# EasyEDA Pro project Sensor_colis_examples.epro, board 2024-06-03_06-10-35
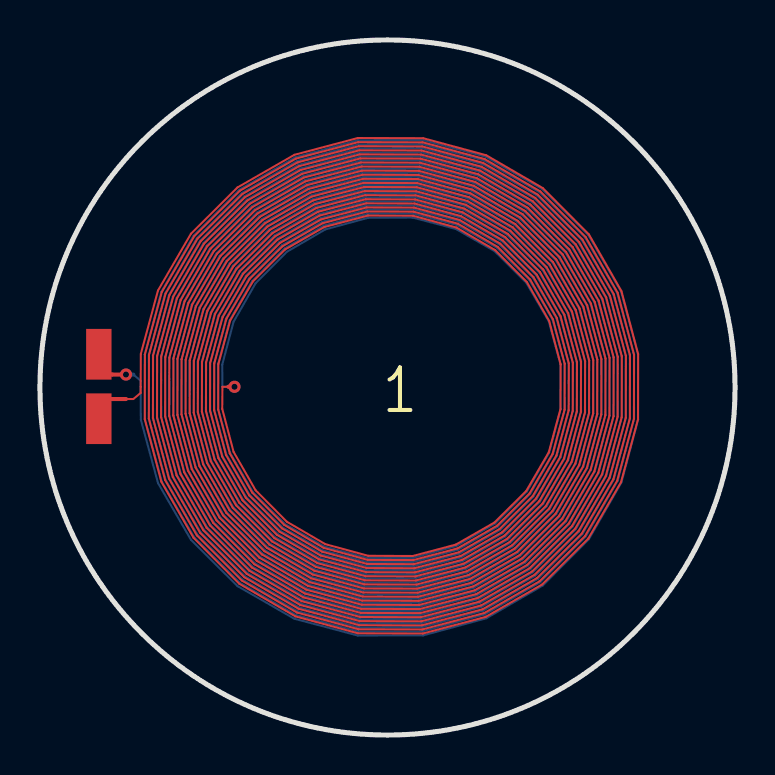
[diagram p0: board, top side]
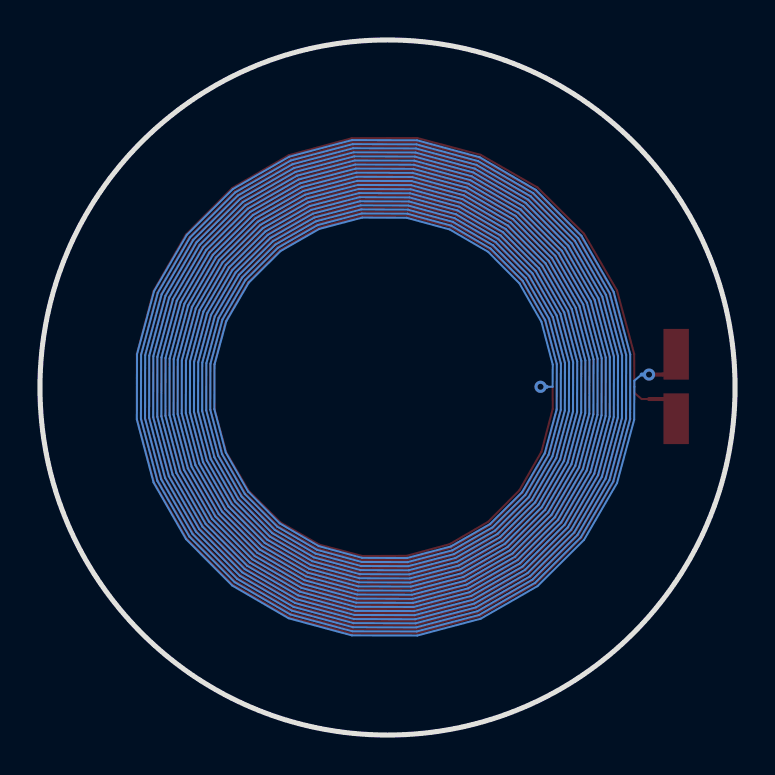
[diagram p1: board, bottom side, seen from below]

Outline 34.8 x 34.8 mm; copper layers: Top Layer, Bottom Layer. Coordinates in mm from the lower left corner of the outline.
Outline path: circle c17.4,17.4 r17.4
Stack: Top Layer 0.035mm - / Dielectric1 1.51mm FR4 er 4.5 / Bottom Layer 0.035mm -

## Design rules (mm)
template: 用户自定义配置
spacing safeClearance (default): track to track 0.152, other pairs 0.152 to 0.3
track width trackWidth (default): min 0.025, default 0.254, max 2.54
differential pair differentialPair (default): width min 0.127, default 0.254, max 2.54; gap min 0.152, default 0.152
via viaSize (default): diameter min 0.5, default 0.61, max 10; hole min 0.3, default 0.305, max 5.999

## Placement (name value [footprint] x y rotation side)
CSENSOR  -  [0402]  2.95 17.53 90 top

## Footprints (pads in the part's own frame, mm; a bottom-side part is the same pattern mirrored in y, then rotated)
0402
  rect 2.54x1.27 smd: 1(-1.689,0) 2(1.536,0)

## Nets
3: CSENSOR.1 CSENSOR.2

## Via types
v1: diameter 0.61, hole 0.305, Top Layer to Bottom Layer, 2 vias

## Routing (per net, layer and track width the routed paths; a pad name or vN(x,y) marks a point on that pad's centre or on a via; arc(x,y) is an arc through that point)
3: length 2649.7
  Top Layer w0.102: 4.31,16.82 4.67,16.82 5.04,17.13 5.04,17.43 5.05,19.08 5.91,22.25 7.56,25.1 9.89,27.41 12.74,29.05 15.91,29.89 19.18,29.88 22.35,29.02 25.18,27.38 27.48,25.06 29.11,22.22 29.95,19.07 29.94,15.8 29.09,12.65 27.45,9.84 25.14,7.54 22.32,5.92 19.17,5.08 15.92,5.09 12.78,5.94 9.98,7.57 7.69,9.87 6.08,12.68 5.25,15.82 5.25,19.05 6.1,22.18 7.72,24.97 10.01,27.25 12.81,28.86 15.93,29.68 19.16,29.67 22.27,28.83 25.05,27.22 27.32,24.93 28.92,22.15 29.74,19.04 29.73,15.83 28.9,12.73 27.29,9.96 25.01,7.7 22.24,6.11 19.14,5.29 15.95,5.3 12.86,6.13 10.1,7.74 7.85,10 6.27,12.76 5.45,15.84 5.46,19.03 6.29,22.1 7.89,24.85 10.14,27.09 12.89,28.67 15.96,29.48 19.13,29.47 22.19,28.64 24.93,27.05 27.16,24.81 28.73,22.07 29.54,19.01 29.53,15.86 28.71,12.81 27.12,10.09 24.89,7.87 22.16,6.3 19.12,5.49 15.97,5.5 12.94,6.32 10.23,7.9 8.02,10.12 6.46,12.84 5.65,15.87 5.66,19 6.48,22.02 8.05,24.72 10.26,26.92 12.97,28.48 15.99,29.27 19.1,29.27 22.11,28.45 24.8,26.89 26.99,24.68 28.54,21.99 29.33,18.99 29.33,15.88 28.52,12.89 26.96,10.21 24.76,8.03 22.08,6.49 19.09,5.7 16,5.71 13.02,6.51 10.35,8.06 8.18,10.25 6.65,12.92 5.86,15.9 5.87,18.97 6.67,21.94 8.21,24.59 10.39,26.76 13.05,28.29 16.01,29.07 19.08,29.06 22.03,28.26 24.67,26.73 26.83,24.56 28.35,21.91 29.13,18.96 29.12,15.91 28.32,12.97 26.8,10.34 24.64,8.19 22,6.68 19.06,5.9 16.03,5.91 13.1,6.7 10.48,8.23 8.34,10.37 6.84,13 6.06,15.92 6.07,18.95 6.86,21.86 8.38,24.47 10.52,26.6 13.13,28.09 16.04,28.87 19.05,28.86 21.95,28.07 24.55,26.56 26.67,24.43 28.16,21.83 28.93,18.93 28.92,15.94 28.13,13.05 26.63,10.46 24.51,8.36 21.92,6.87 19.04,6.11 16.05,6.11 13.18,6.89 10.6,8.39 8.51,10.5 7.03,13.08 6.27,15.95 6.28,18.92 7.05,21.78 8.54,24.34 10.64,26.43 13.21,27.91 16.07,28.66 19.02,28.65 21.87,27.88 24.42,26.4 26.5,24.31 27.97,21.75 28.72,18.91 28.71,15.96 27.94,13.13 26.47,10.59 24.39,8.52 21.84,7.06 19.01,6.31 16.08,6.32 13.26,7.08 10.73,8.55 8.67,10.62 7.22,13.16 6.47,15.98 6.48,18.89 7.24,21.7 8.7,24.22 10.77,26.27 13.29,27.71 16.09,28.46 19,28.45 21.79,27.69 24.3,26.23 26.34,24.18 27.78,21.67 28.52,18.88 28.51,15.99 27.75,13.21 26.3,10.71 24.26,8.68 21.76,7.25 18.98,6.51 16.11,6.52 13.34,7.27 10.86,8.72 8.83,10.75 7.41,13.24 6.68,16 6.68,18.86 7.43,21.62 8.87,24.09 10.89,26.11 13.37,27.52 16.12,28.25 18.97,28.25 21.72,27.5 24.17,26.07 26.18,24.06 27.59,21.59 28.31,18.85 28.3,16.02 27.56,13.29 26.14,10.84 24.14,8.84 21.69,7.44 18.96,6.72 16.14,6.73 13.42,7.46 10.98,8.88 9,10.88 7.6,13.31 6.88,16.03 6.89,18.84 7.62,21.55 9.03,23.97 11.02,25.94 13.44,27.33 16.15,28.05 18.94,28.04 21.64,27.31 24.05,25.91 26.01,23.93 27.4,21.52 28.11,18.83 28.1,16.05 27.37,13.36 25.98,10.96 24.01,9.01 21.61,7.63 18.93,6.92 16.16,6.93 13.49,7.65 11.11,9.04 9.16,11 7.79,13.39 7.08,16.06 7.09,18.81 7.81,21.47 9.19,23.84 11.14,25.78 13.52,27.14 16.17,27.84 18.91,27.84 21.56,27.12 23.92,25.74 25.85,23.81 27.21,21.44 27.91,18.8 27.9,16.07 27.18,13.44 25.81,11.09 23.89,9.17 21.53,7.82 18.9,7.13 16.19,7.13 13.57,7.84 11.23,9.21 9.32,11.13 7.98,13.47 7.29,16.08 7.3,18.78 8,21.39 9.36,23.72 11.27,25.62 13.6,26.95 16.2,27.64 18.89,27.63 21.48,26.93 23.8,25.58 25.69,23.68 27.02,21.36 27.7,18.77 27.69,16.1 26.99,13.52 25.65,11.21 23.76,9.34 21.45,8.01 18.88,7.33 16.22,7.34 13.65,8.03 11.36,9.37 9.49,11.25 8.17,13.55 7.49,16.11 7.5,18.76 8.19,21.31 9.52,23.59 11.39,25.45 13.68,26.76 16.23,27.44 18.86,27.43 21.4,26.74 23.67,25.42 25.52,23.56 26.83,21.28 27.5,18.74 27.49,16.13 26.8,13.6 25.49,11.34 23.63,9.5 21.37,8.2 18.85,7.53 16.24,7.54 13.73,8.23 11.48,9.53 9.65,11.38 8.36,13.63 7.7,16.14 7.7,18.73 8.38,21.23 9.69,23.47 11.52,25.29 13.76,26.57 16.26,27.23 18.83,27.22 21.32,26.55 23.55,25.25 25.36,23.43 26.64,21.2 27.29,18.72 27.28,16.15 26.61,13.68 25.32,11.47 23.51,9.66 21.29,8.39 18.82,7.74 16.27,7.75 13.81,8.42 11.61,9.7 9.81,11.5 8.55,13.71 7.9,16.17 7.91,18.7 8.57,21.15 9.85,23.34 11.64,25.12 13.84,26.38 16.28,27.03 18.81,27.02 21.24,26.36 23.42,25.09 25.2,23.3 26.45,21.12 27.09,18.69 27.08,16.18 26.42,13.76 25.16,11.59 23.38,9.83 21.21,8.58 18.79,7.94 16.3,7.95 13.89,8.61 11.73,9.86 9.98,11.63 8.74,13.79 8.1,16.19 8.11,18.68 8.76,21.07 10.01,23.22 11.77,24.96 13.92,26.19 16.31,26.82 18.78,26.82 21.16,26.17 23.29,24.93 25.03,23.18 26.26,21.04 26.88,18.66 26.88,16.21 26.23,13.84 25,11.72 23.26,9.99 21.13,8.77 18.77,8.15 16.32,8.16 13.97,8.8 11.86,10.02 10.14,11.75 8.93,13.87 8.31,16.22 8.32,18.65 8.95,20.99 10.17,23.09 11.89,24.8 14,26 16.34,26.62 18.75,26.61 21.08,25.98 23.17,24.76 24.87,23.05 26.07,20.96 26.68,18.64 26.67,16.23 26.04,13.92 24.83,11.84 23.13,10.15 21.05,8.96 18.74,8.35 16.35,8.36 14.05,8.99 11.98,10.19 10.3,11.88 9.12,13.95 8.51,16.25 8.52,18.62 9.14,20.91 10.34,22.97 12.02,24.64 14.08,25.81 16.36,26.42 18.73,26.41 21.01,25.79 23.04,24.6 24.7,22.93 25.88,20.88 26.48,18.61 26.47,16.26 25.85,13.99 24.67,11.97 23.01,10.32 20.98,9.15 18.71,8.56 16.38,8.56 14.12,9.18 12.11,10.35 10.47,12 9.31,14.02 8.72,16.27 8.73,18.6 9.33,20.84 10.5,22.84 12.15,24.47 14.15,25.62 16.39,26.21 18.7,26.2 20.93,25.6 22.92,24.44 24.54,22.8 25.68,20.81 26.27,18.58 26.26,16.29 25.66,14.07 24.51,12.09 22.88,10.48 20.9,9.34 18.69,8.76 16.4,8.77 14.2,9.37 12.23,10.51 10.63,12.13 9.5,14.1 8.92,16.3 8.93,18.57 9.53,20.76 10.67,22.71 12.27,24.31 14.23,25.43 16.42,26.01 18.67,26 20.85,25.41 22.79,24.27 24.38,22.68 25.49,20.73 26.07,18.56 26.06,16.31 25.47,14.15 24.34,12.22 22.76,10.64 20.82,9.53 18.66,8.96 16.43,8.97 14.28,9.56 12.36,10.68 10.79,12.25 9.69,14.18 9.13,16.33 9.13,17.43 9.44,17.43
  Top Layer w0.204: 2.94,18.22 2.94,18.13 3.62,18.05 v1(4.31,18.05) ; 9.44,17.43 v1(9.74,17.43) ; 4.31,16.82 2.94,16.82
  Bottom Layer w0.102: 4.67,18.05 5.04,17.74 5.04,17.43 5.05,15.79 5.91,12.62 7.56,9.77 9.89,7.46 12.74,5.82 15.91,4.98 19.18,4.99 22.35,5.85 25.18,7.49 27.48,9.81 29.11,12.64 29.95,15.8 29.94,19.07 29.09,22.22 27.45,25.03 25.14,27.33 22.32,28.95 19.17,29.79 15.92,29.78 12.78,28.93 9.98,27.3 7.69,25 6.08,22.19 5.25,19.05 5.25,15.82 6.1,12.69 7.72,9.9 10.01,7.62 12.81,6.01 15.93,5.19 19.16,5.19 22.27,6.04 25.05,7.65 27.32,9.93 28.92,12.72 29.74,15.83 29.73,19.04 28.9,22.14 27.29,24.91 25.01,27.17 22.24,28.76 19.14,29.58 15.95,29.57 12.86,28.74 10.1,27.13 7.85,24.87 6.27,22.11 5.45,19.03 5.46,15.84 6.29,12.77 7.89,10.02 10.14,7.78 12.89,6.2 15.96,5.39 19.13,5.4 22.19,6.23 24.93,7.82 27.16,10.06 28.73,12.8 29.54,15.86 29.53,19.01 28.71,22.06 27.12,24.78 24.89,27 22.16,28.57 19.12,29.38 15.97,29.37 12.94,28.55 10.23,26.97 8.02,24.75 6.46,22.03 5.65,19 5.66,15.87 6.48,12.85 8.05,10.15 10.26,7.95 12.97,6.39 15.99,5.59 19.1,5.6 22.11,6.42 24.8,7.98 26.99,10.19 28.54,12.88 29.33,15.88 29.33,18.99 28.52,21.98 26.96,24.66 24.76,26.84 22.08,28.38 19.09,29.17 16,29.16 13.02,28.36 10.35,26.81 8.18,24.62 6.65,21.95 5.86,18.97 5.87,15.9 6.67,12.93 8.21,10.27 10.39,8.11 13.05,6.58 16.01,5.8 19.08,5.81 22.03,6.61 24.67,8.14 26.83,10.31 28.35,12.96 29.13,15.91 29.12,18.96 28.32,21.9 26.8,24.53 24.64,26.68 22,28.19 19.06,28.97 16.03,28.96 13.1,28.17 10.48,26.64 8.34,24.5 6.84,21.87 6.06,18.95 6.07,15.92 6.86,13.01 8.38,10.4 10.52,8.27 13.13,6.77 16.04,6 19.05,6.01 21.95,6.8 24.55,8.31 26.67,10.44 28.16,13.04 28.93,15.94 28.92,18.93 28.13,21.82 26.63,24.41 24.51,26.51 21.92,28 19.04,28.76 16.05,28.76 13.18,27.98 10.6,26.48 8.51,24.37 7.03,21.79 6.27,18.92 6.28,15.95 7.05,13.09 8.54,10.53 10.64,8.44 13.21,6.96 16.07,6.21 19.02,6.22 21.87,6.99 24.42,8.47 26.5,10.56 27.97,13.12 28.72,15.96 28.71,18.91 27.94,21.74 26.47,24.28 24.39,26.35 21.84,27.81 19.01,28.56 16.08,28.55 13.26,27.79 10.73,26.32 8.67,24.25 7.22,21.71 6.47,18.89 6.48,15.98 7.24,13.17 8.7,10.65 10.77,8.6 13.29,7.15 16.09,6.41 19,6.42 21.79,7.18 24.3,8.63 26.34,10.69 27.78,13.2 28.52,15.99 28.51,18.88 27.75,21.66 26.3,24.16 24.26,26.19 21.76,27.62 18.98,28.36 16.11,28.35 13.34,27.6 10.86,26.15 8.83,24.12 7.41,21.63 6.68,18.87 6.68,16 7.43,13.25 8.87,10.78 10.89,8.76 13.37,7.34 16.12,6.62 18.97,6.62 21.72,7.37 24.17,8.8 26.18,10.81 27.59,13.28 28.31,16.02 28.3,18.85 27.56,21.58 26.14,24.03 24.14,26.02 21.69,27.43 18.96,28.15 16.14,28.14 13.42,27.41 10.98,25.99 9,23.99 7.6,21.55 6.88,18.84 6.89,16.03 7.62,13.32 9.03,10.9 11.02,8.93 13.44,7.54 16.15,6.82 18.94,6.83 21.64,7.56 24.05,8.96 26.01,10.94 27.4,13.35 28.11,16.04 28.1,18.82 27.37,21.51 25.98,23.91 24.01,25.86 21.61,27.24 18.93,27.95 16.16,27.94 13.49,27.22 11.11,25.83 9.16,23.87 7.79,21.48 7.08,18.81 7.09,16.06 7.81,13.4 9.19,11.03 11.14,9.09 13.52,7.73 16.17,7.02 18.91,7.03 21.56,7.75 23.92,9.12 25.85,11.06 27.21,13.43 27.91,16.07 27.9,18.8 27.18,21.43 25.81,23.78 23.89,25.7 21.53,27.05 18.9,27.74 16.19,27.73 13.57,27.02 11.23,25.66 9.32,23.74 7.98,21.4 7.29,18.79 7.3,16.09 8,13.48 9.36,11.15 11.27,9.25 13.6,7.92 16.2,7.23 18.89,7.24 21.48,7.94 23.8,9.29 25.69,11.19 27.02,13.51 27.7,16.1 27.69,18.77 26.99,21.35 25.65,23.65 23.76,25.53 21.45,26.86 18.88,27.54 16.22,27.53 13.65,26.83 11.36,25.5 9.49,23.62 8.17,21.32 7.49,18.76 7.5,16.11 8.19,13.56 9.52,11.28 11.39,9.42 13.68,8.11 16.23,7.43 18.86,7.44 21.4,8.13 23.67,9.45 25.52,11.31 26.83,13.59 27.5,16.12 27.49,18.74 26.8,21.27 25.49,23.53 23.63,25.37 21.37,26.67 18.85,27.33 16.24,27.33 13.73,26.64 11.48,25.34 9.65,23.49 8.36,21.24 7.7,18.73 7.7,16.14 8.38,13.64 9.69,11.4 11.52,9.58 13.76,8.3 16.26,7.64 18.83,7.65 21.32,8.32 23.55,9.61 25.36,11.44 26.64,13.67 27.29,16.15 27.28,18.72 26.61,21.19 25.32,23.4 23.51,25.21 21.29,26.48 18.82,27.13 16.27,27.12 13.81,26.45 11.61,25.17 9.81,23.37 8.55,21.16 7.9,18.7 7.91,16.17 8.57,13.72 9.85,11.53 11.64,9.74 13.84,8.49 16.28,7.84 18.81,7.85 21.24,8.51 23.42,9.78 25.2,11.56 26.45,13.75 27.09,16.18 27.08,18.69 26.42,21.11 25.16,23.28 23.38,25.04 21.21,26.29 18.79,26.93 16.3,26.92 13.89,26.26 11.73,25.01 9.98,23.24 8.74,21.08 8.1,18.68 8.11,16.19 8.76,13.8 10.01,11.65 11.77,9.91 13.92,8.68 16.31,8.05 18.78,8.05 21.16,8.7 23.29,9.94 25.03,11.69 26.26,13.83 26.88,16.21 26.88,18.66 26.23,21.03 25,23.15 23.26,24.88 21.13,26.1 18.77,26.72 16.32,26.71 13.97,26.07 11.86,24.85 10.14,23.12 8.93,21 8.31,18.65 8.32,16.22 8.95,13.88 10.17,11.78 11.89,10.07 14,8.87 16.34,8.25 18.75,8.26 21.08,8.89 23.17,10.11 24.87,11.82 26.07,13.91 26.68,16.23 26.67,18.64 26.04,20.95 24.83,23.03 23.13,24.72 21.05,25.91 18.74,26.52 16.35,26.51 14.05,25.88 11.98,24.68 10.3,22.99 9.12,20.92 8.51,18.62 8.52,16.25 9.14,13.96 10.34,11.9 12.02,10.23 14.08,9.06 16.36,8.45 18.73,8.46 21.01,9.08 23.04,10.27 24.7,11.94 25.88,13.98 26.48,16.26 26.47,18.61 25.85,20.88 24.67,22.9 23.01,24.55 20.98,25.72 18.71,26.31 16.38,26.31 14.12,25.69 12.11,24.52 10.47,22.87 9.31,20.85 8.72,18.6 8.73,16.27 9.33,14.03 10.5,12.03 12.15,10.4 14.15,9.25 16.39,8.66 18.7,8.67 20.93,9.27 22.92,10.43 24.54,12.07 25.68,14.06 26.27,16.29 26.26,18.58 25.66,20.8 24.51,22.78 22.88,24.39 20.9,25.53 18.69,26.11 16.4,26.1 14.2,25.5 12.23,24.36 10.63,22.74 9.5,20.77 8.92,18.57 8.93,16.3 9.53,14.11 10.67,12.16 12.27,10.56 14.23,9.44 16.42,8.86 18.67,8.87 20.85,9.46 22.79,10.59 24.38,12.19 25.49,14.14 26.07,16.31 26.06,18.56 25.47,20.72 24.34,22.65 22.76,24.23 20.82,25.34 18.66,25.91 16.43,25.9 14.28,25.31 12.36,24.19 10.79,22.61 9.69,20.69 9.13,18.54 9.13,17.43 9.44,17.43
  Bottom Layer w0.204: 9.44,17.43 v1(9.74,17.43) ; v1(4.31,18.05) 4.67,18.05

## Text on the board
Top Silkscreen Layer: Layers = 2 | Turns = 20 | Version - 1.1 | -------------- | Design Id - 103 | Coil Parameters | Customized for LDC1614 | Trace Width = 4.02 mils | Layer Stack Information | ------------------------- | Trace Spacing = 4.02 mils | WEBENCH Design Information | Copper thickness = 1.0 Oz-Cu | Exported on - 2024/06/03 06:10:33 | Inner Diameter = 663 mils (Approx.) | Outer Diameter = 985 mils (Approx.) | Space between TOP and BOTTOM = 4.0 mils | Exported from WEBENCH Coil Designer Tool | 1
